# Altium schematic sheet 0093_CONNECTIVITY - M.SchDoc
size 848 x 558 mm
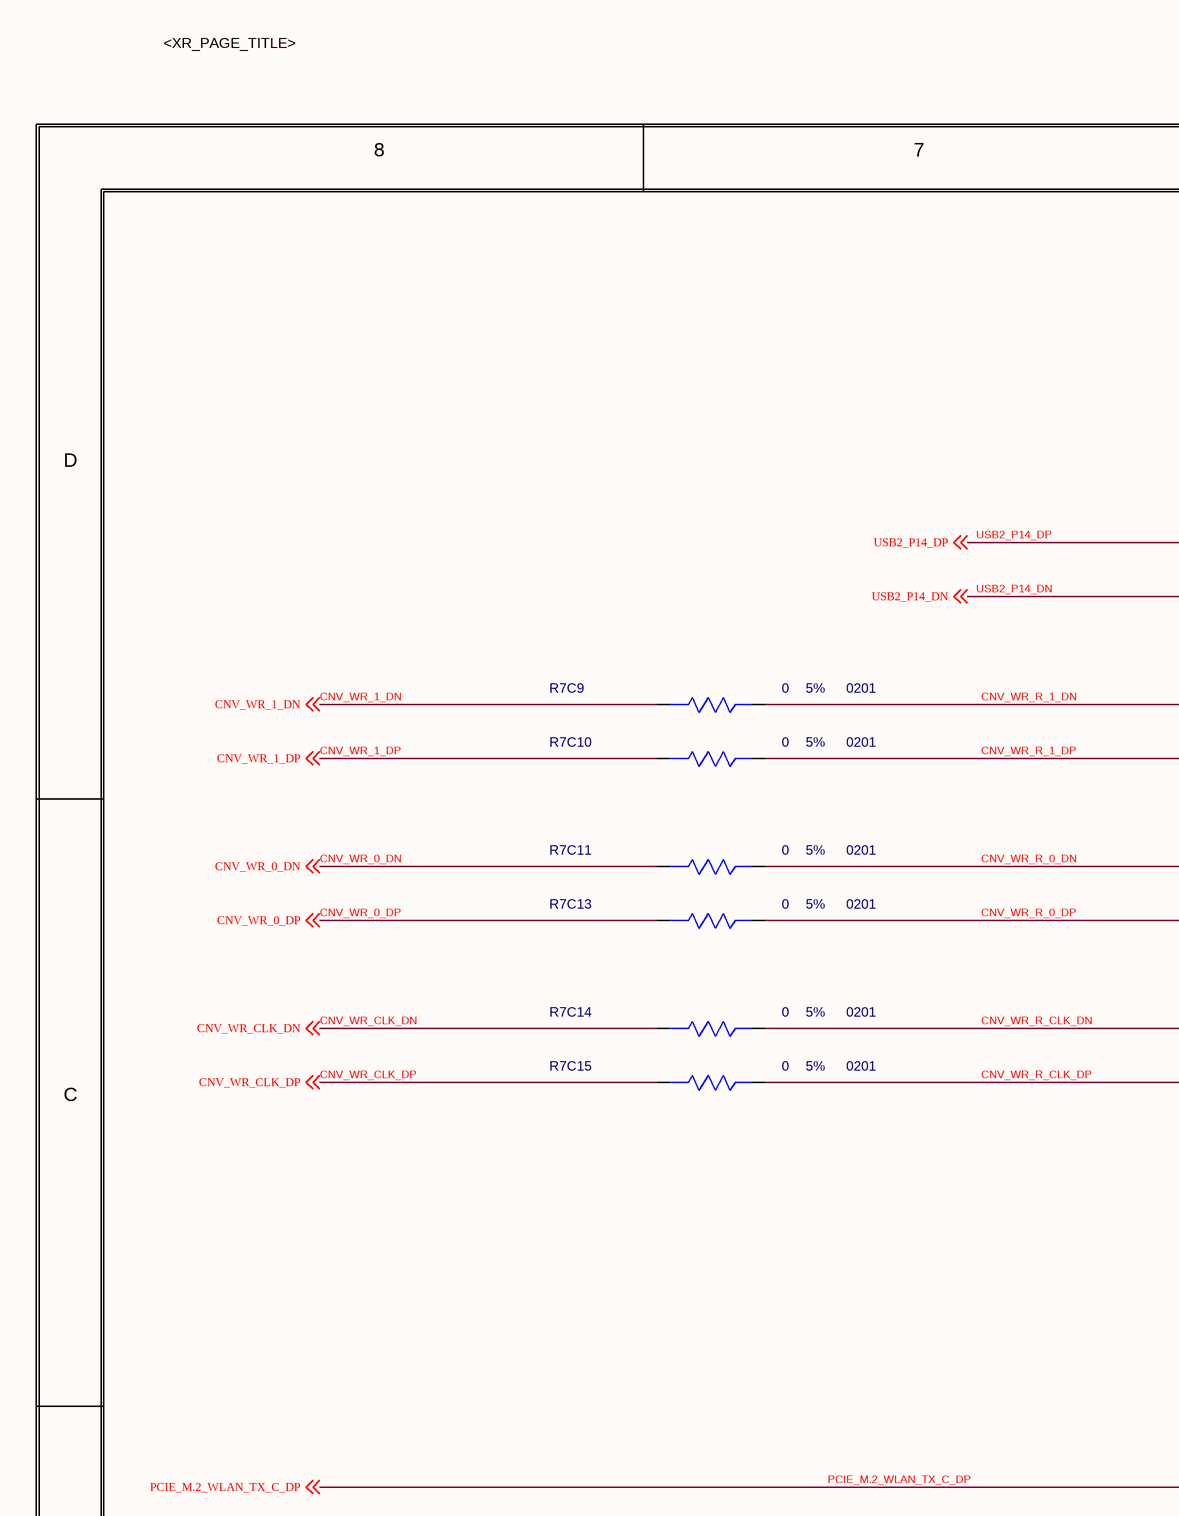
[diagram p0: 0093_CONNECTIVITY - M.SchDoc, top left]
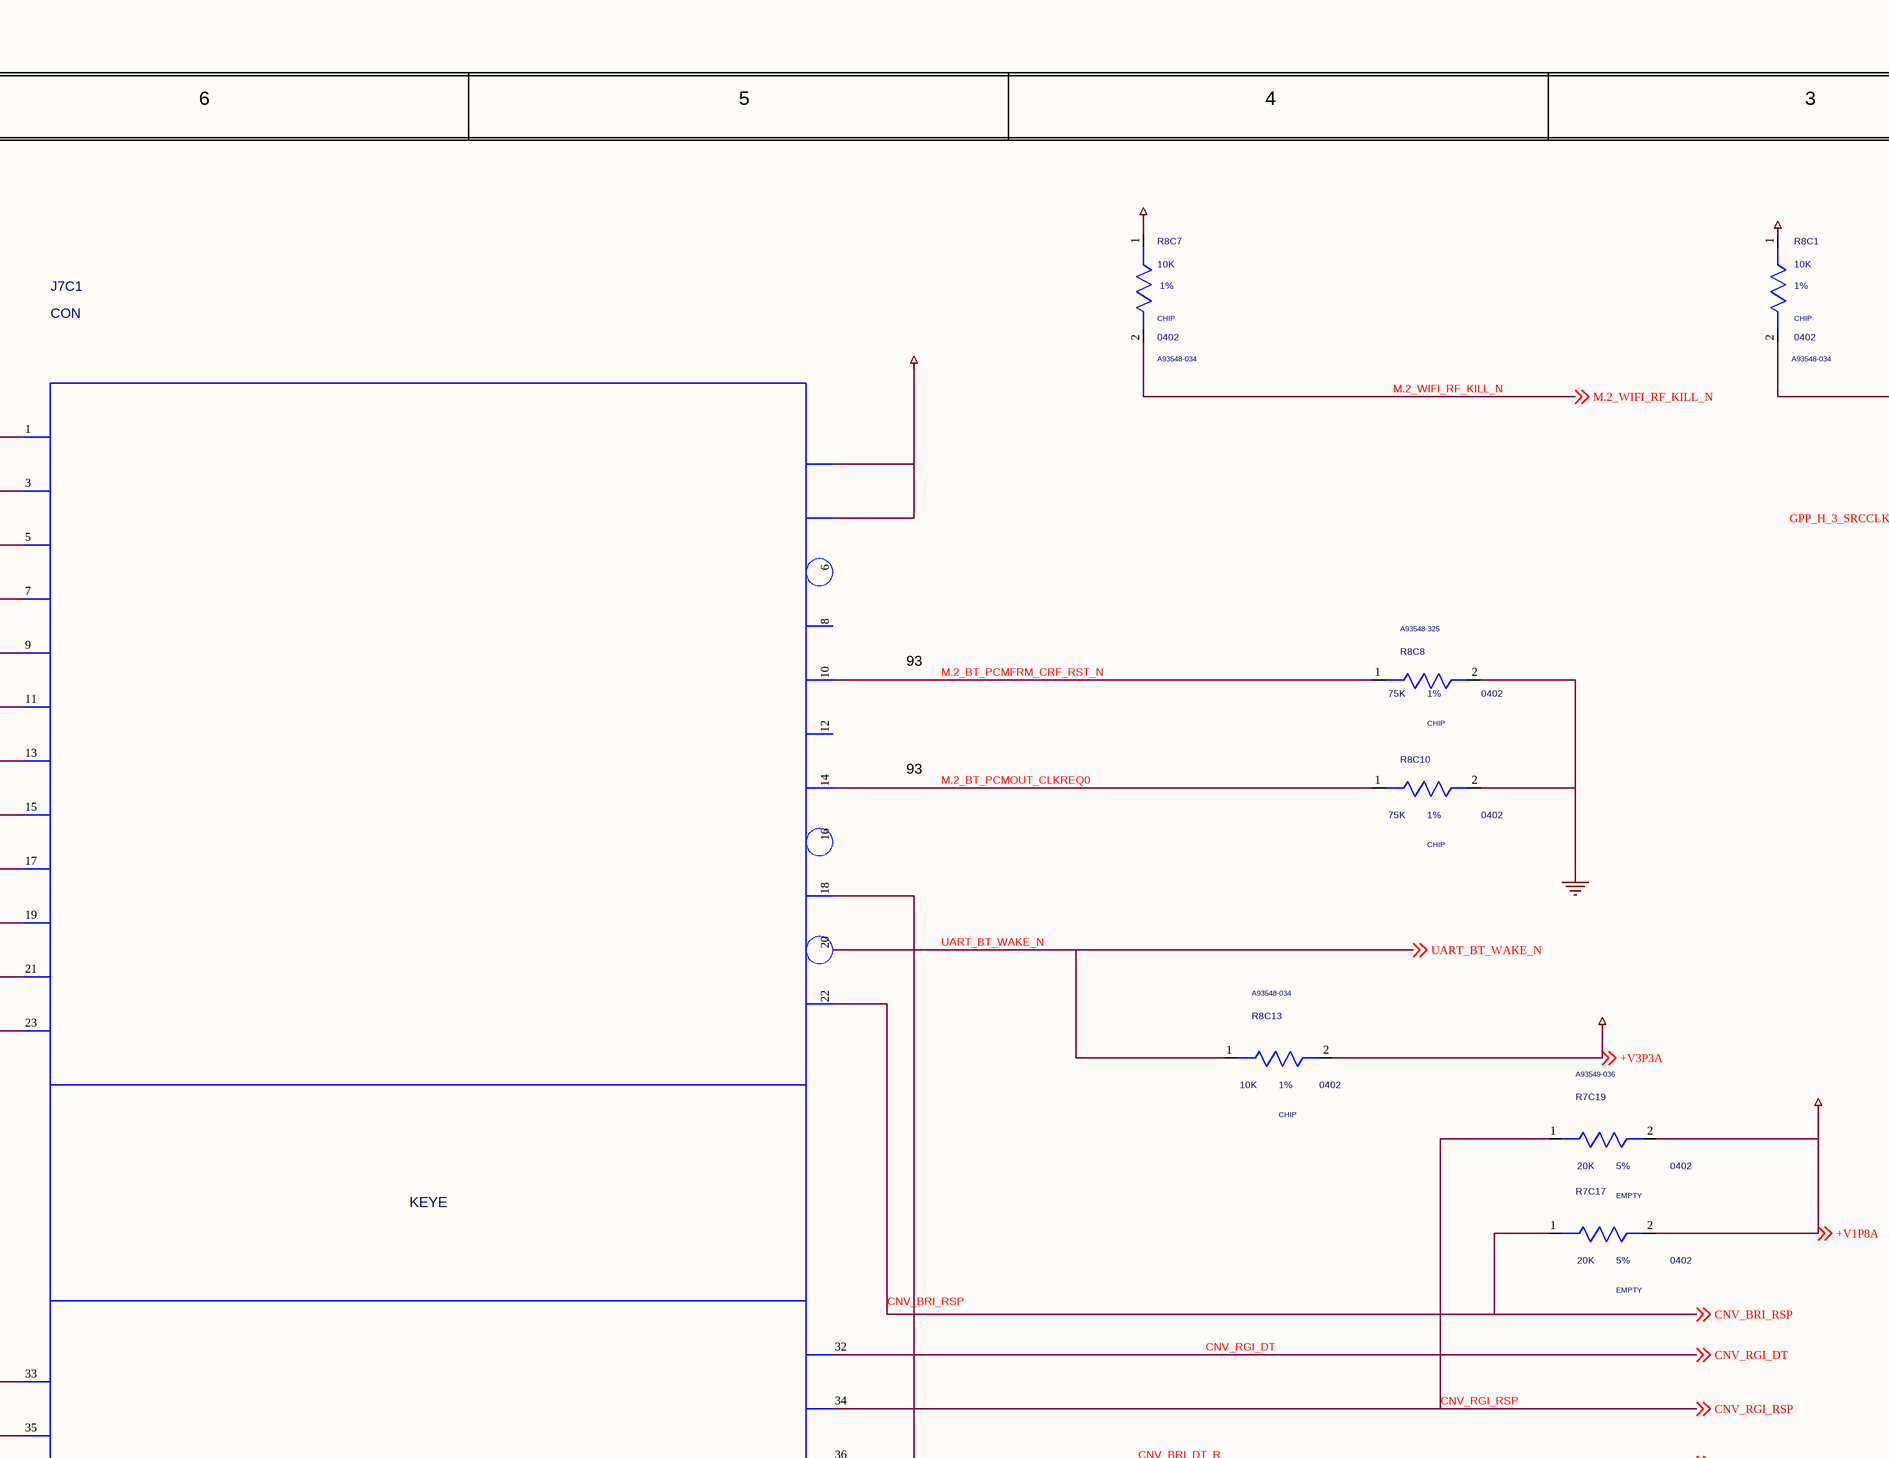
[diagram p1: 0093_CONNECTIVITY - M.SchDoc, top middle]
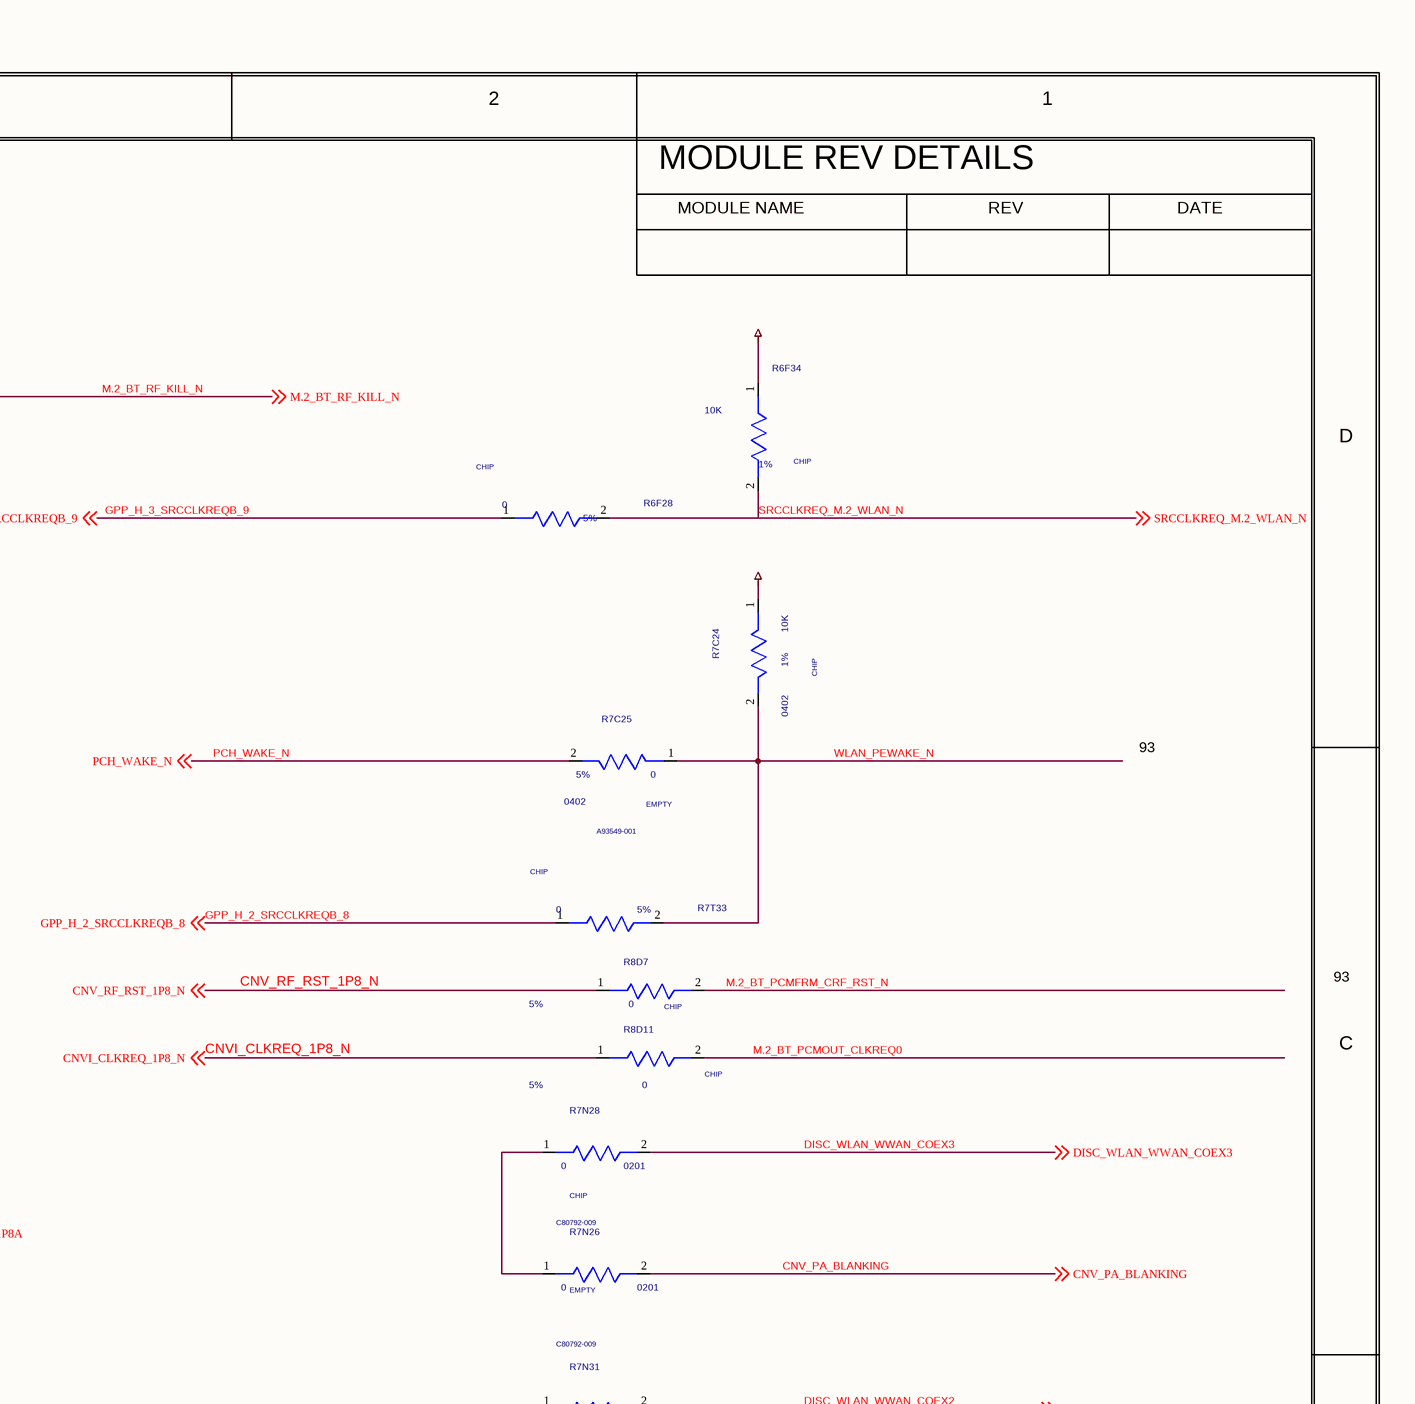
[diagram p2: 0093_CONNECTIVITY - M.SchDoc, top right]
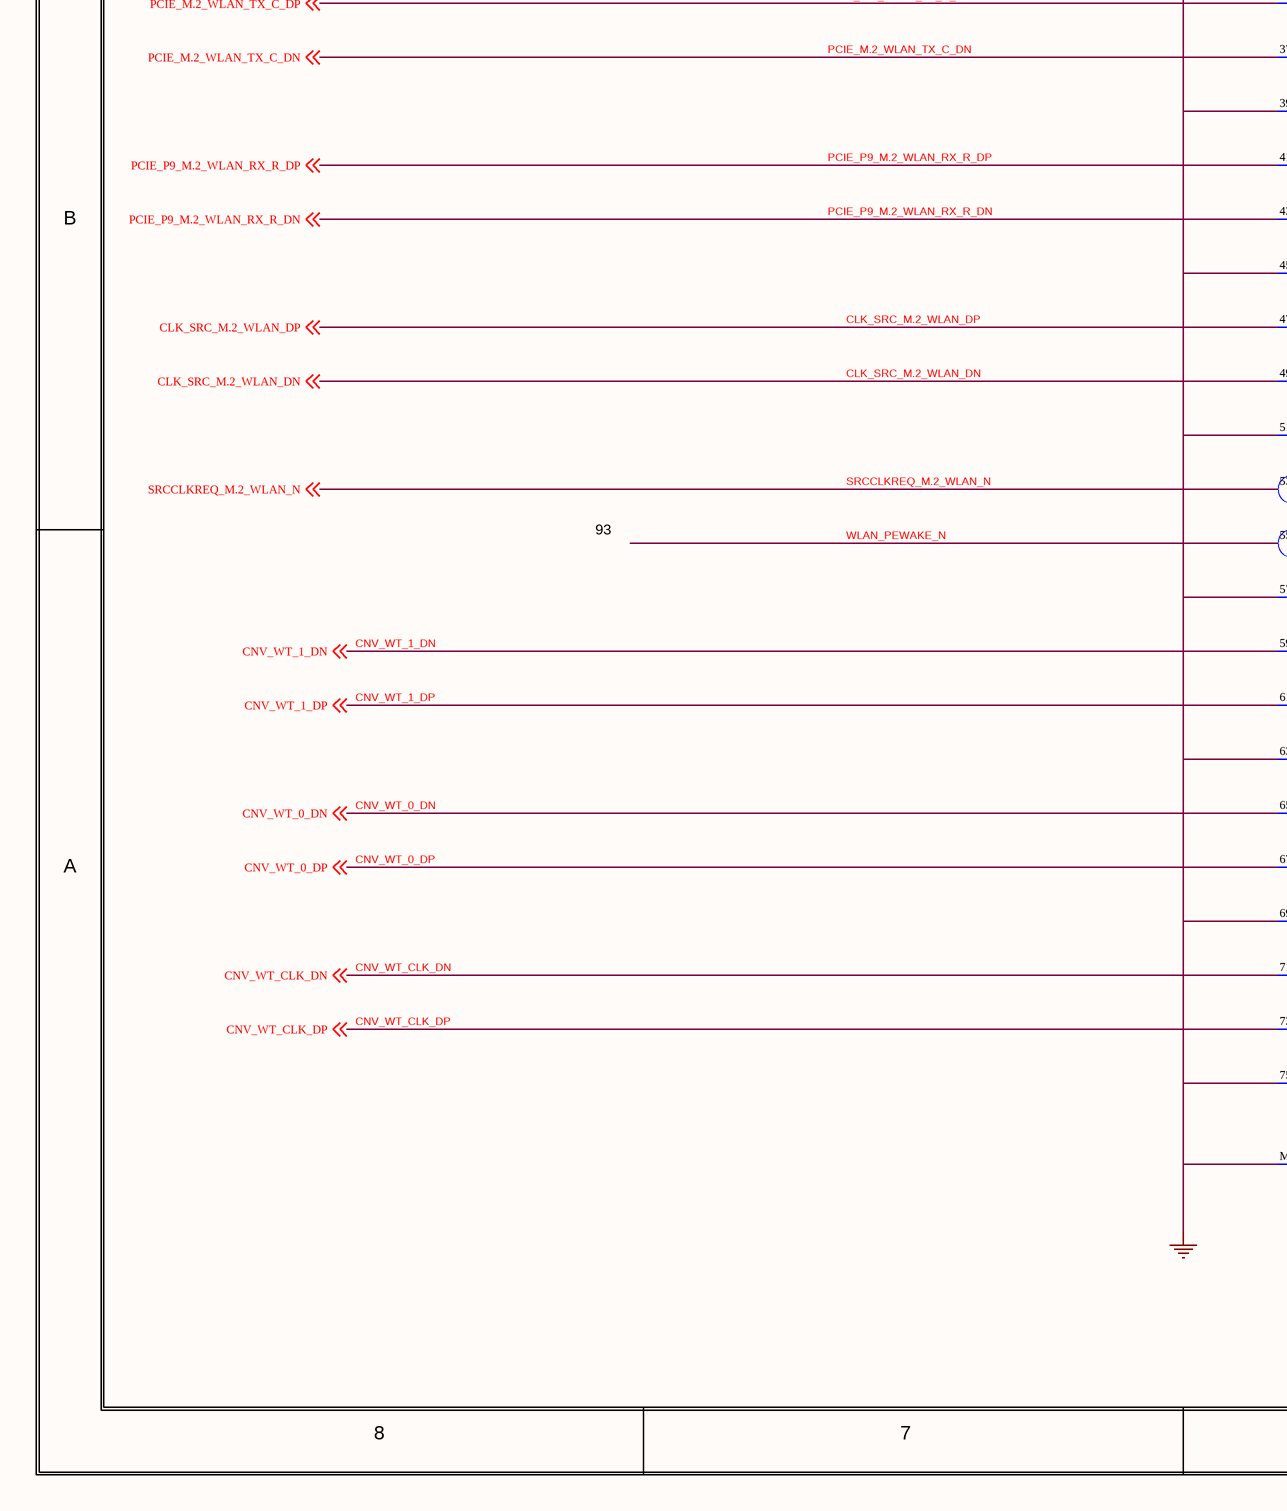
[diagram p3: 0093_CONNECTIVITY - M.SchDoc, bottom left]
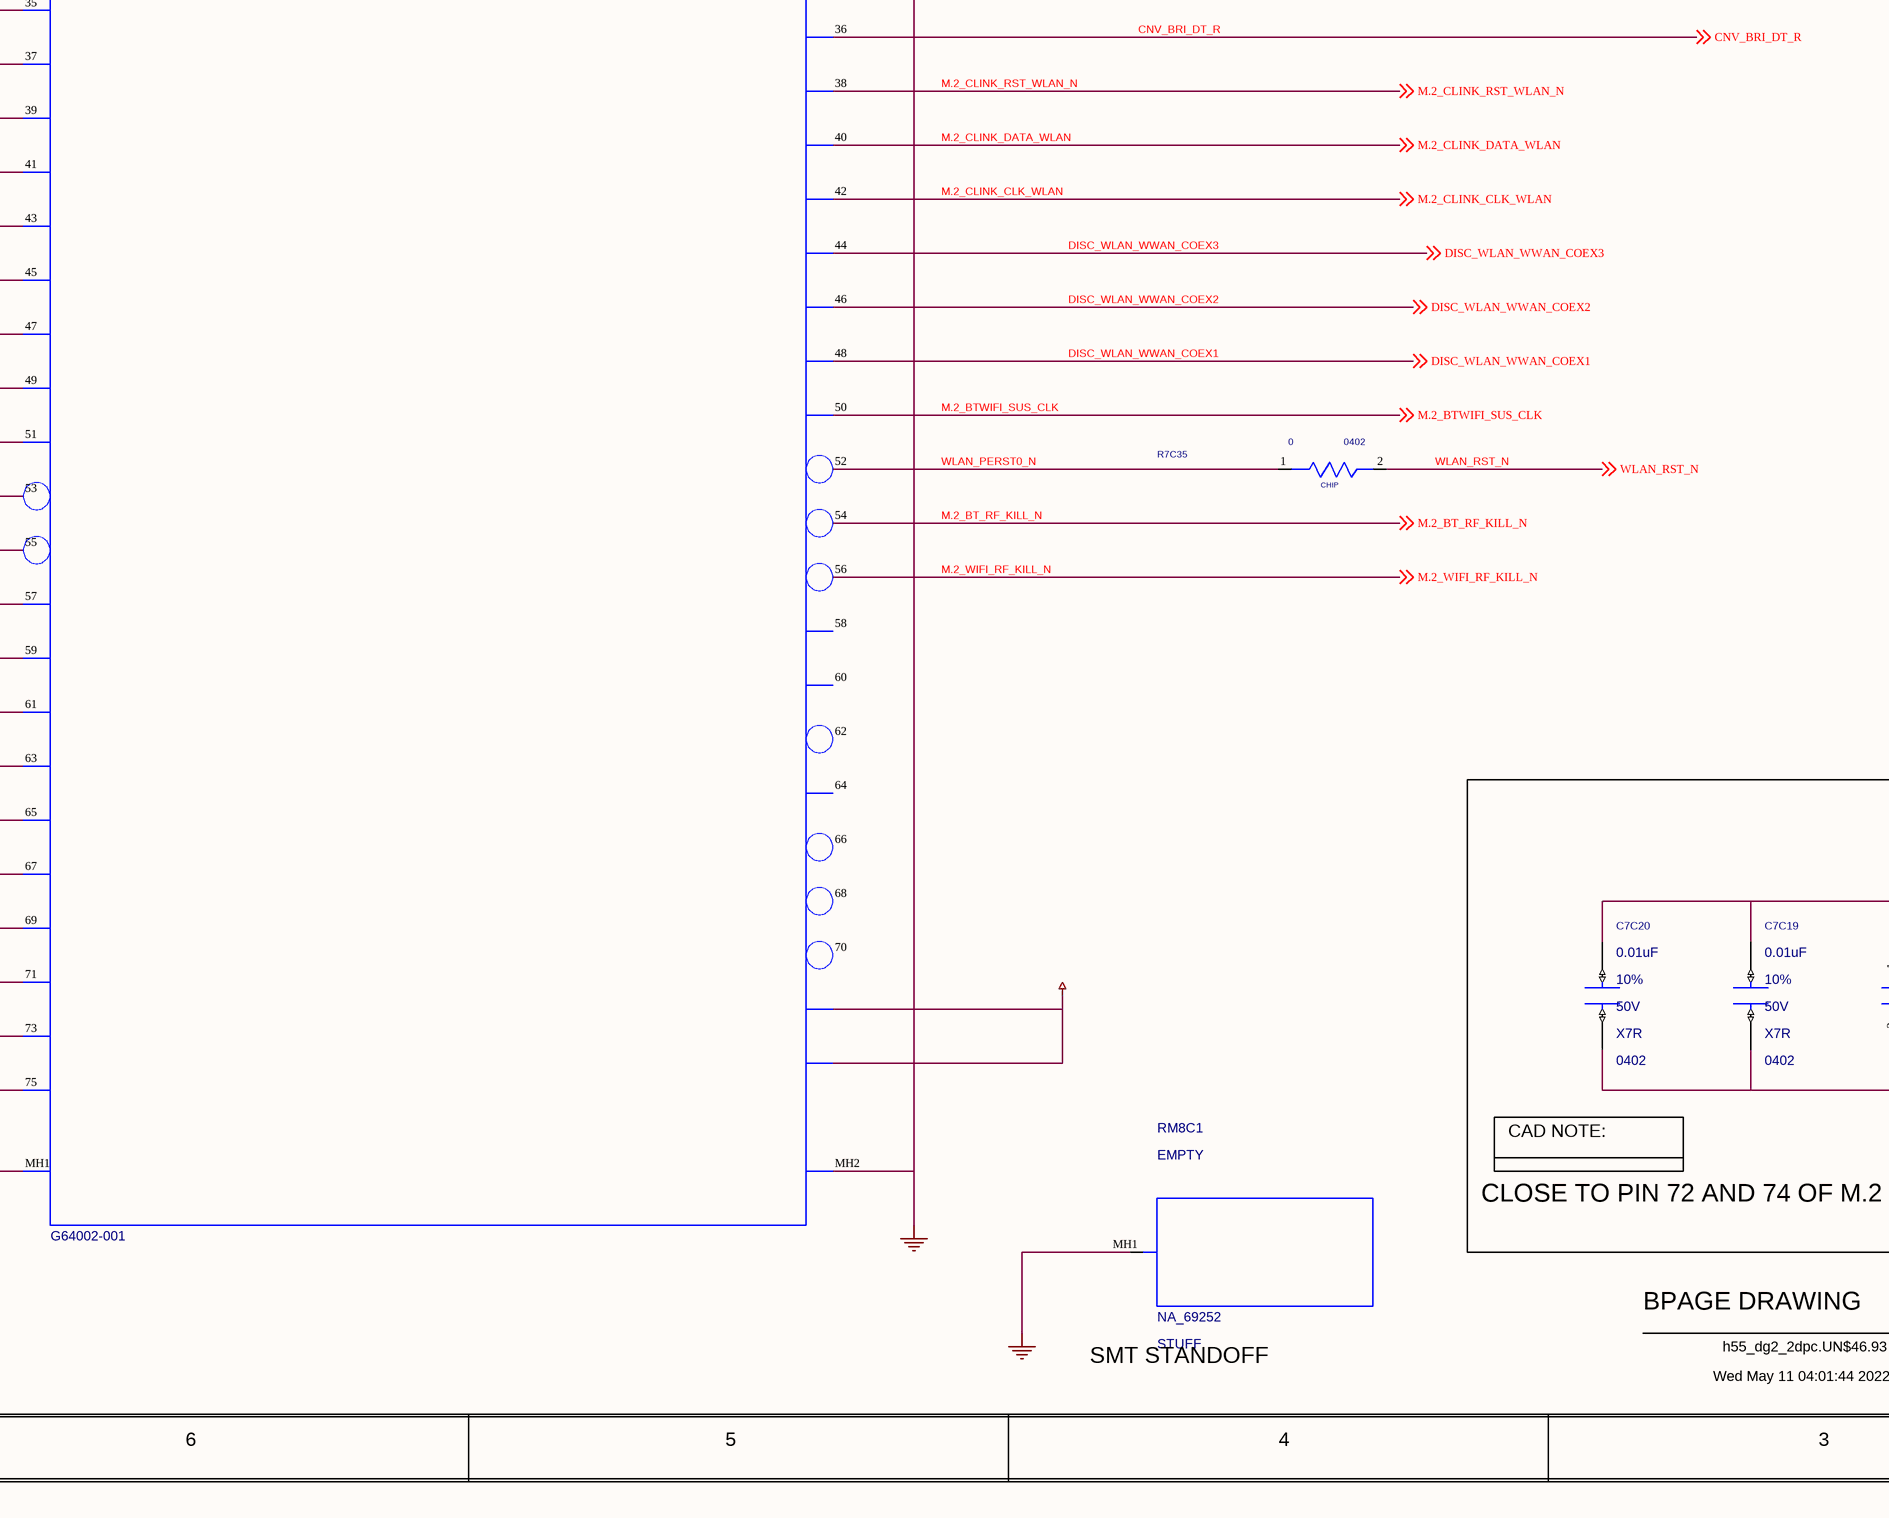
[diagram p4: 0093_CONNECTIVITY - M.SchDoc, bottom middle]
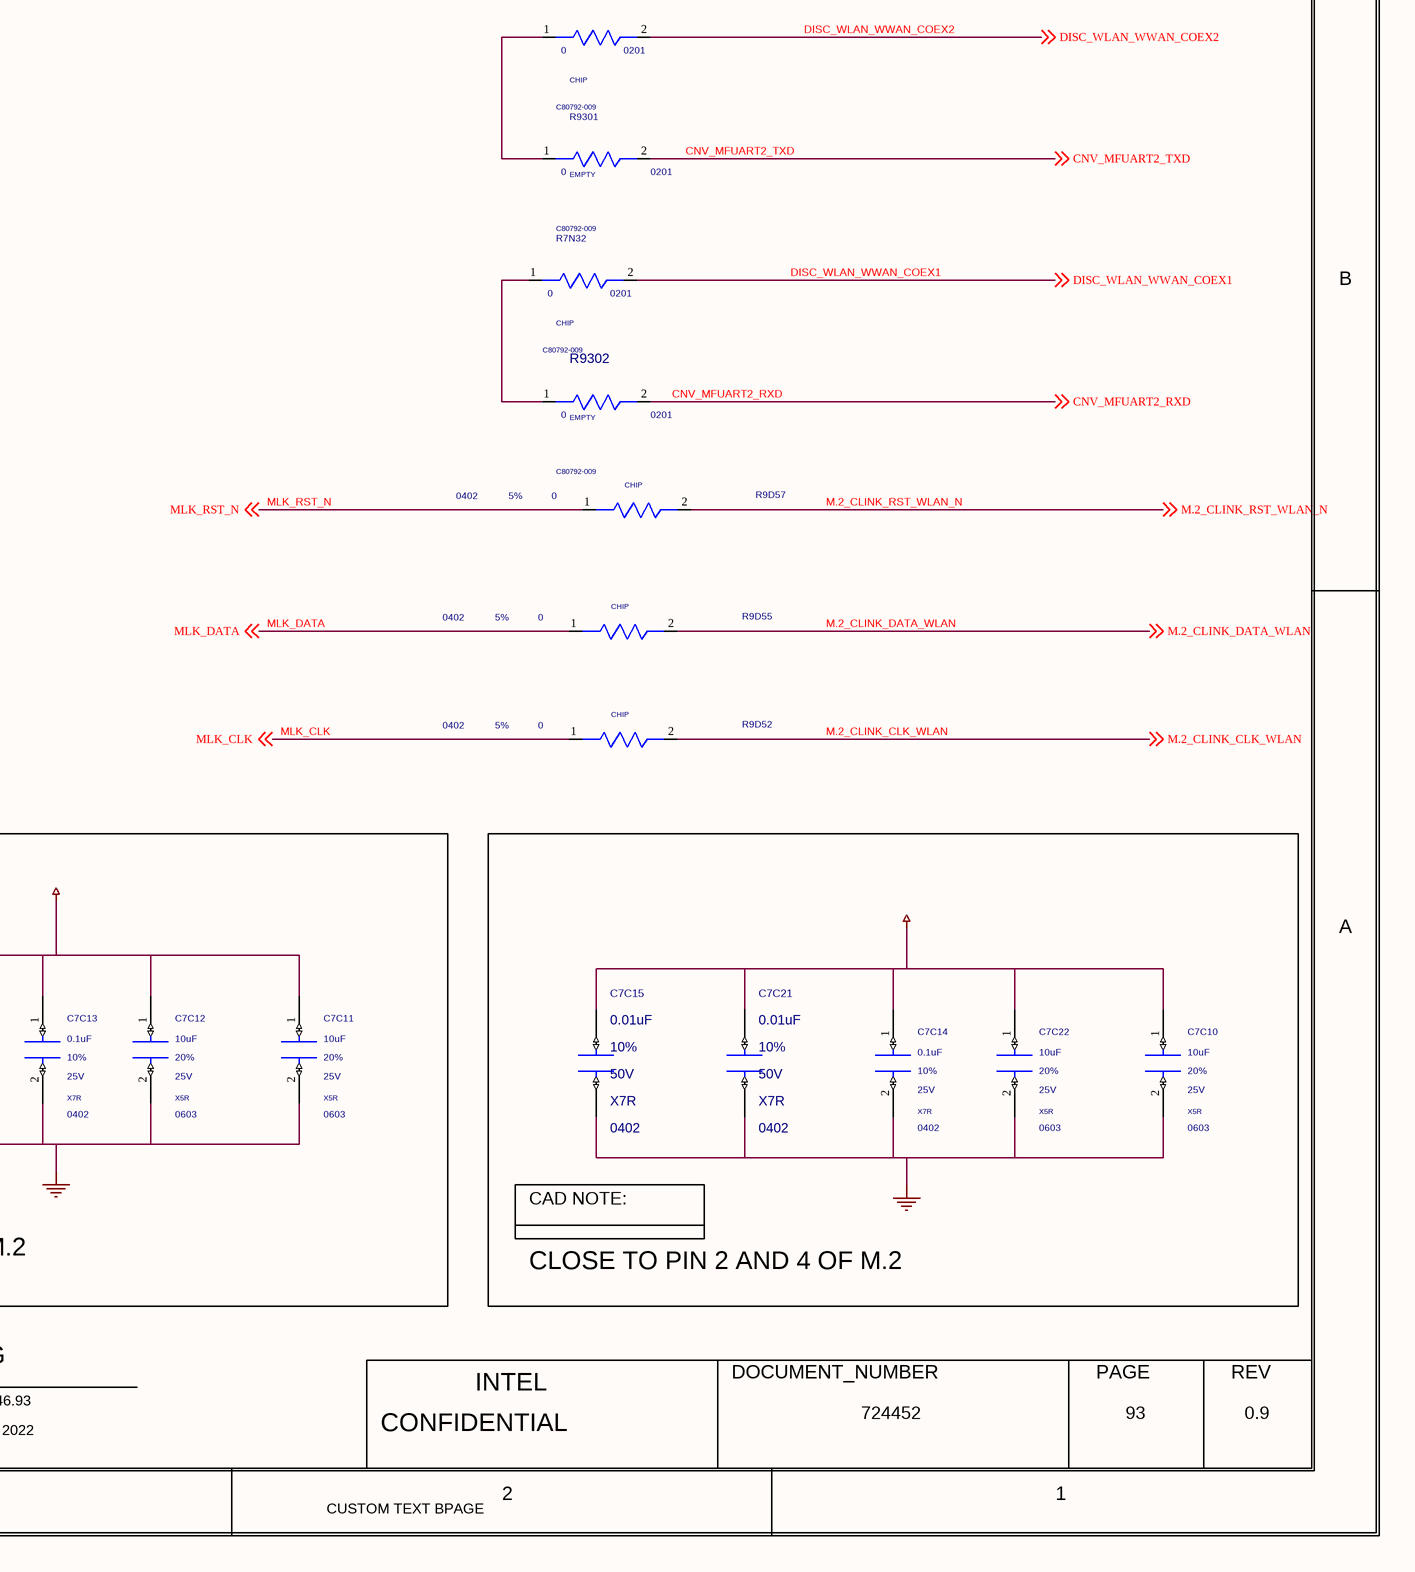
[diagram p5: 0093_CONNECTIVITY - M.SchDoc, bottom right]

## Parts
C7C10  10uF  MATERIAL: X5R  PACK_TYPE: 0603  TOLERANCE: 20%  VOLTAGE: 25V  [SMC0603IA]
C7C11  10uF  MATERIAL: X5R  PACK_TYPE: 0603  TOLERANCE: 20%  VOLTAGE: 25V  [SMC0603IA]
C7C12  10uF  MATERIAL: X5R  PACK_TYPE: 0603  TOLERANCE: 20%  VOLTAGE: 25V  [SMC0603IA]
C7C13  0.1uF  MATERIAL: X7R  PACK_TYPE: 0402  TOLERANCE: 10%  VOLTAGE: 25V  [SMC0402IA]
C7C14  0.1uF  MATERIAL: X7R  PACK_TYPE: 0402  TOLERANCE: 10%  VOLTAGE: 25V  [SMC0402IA]
C7C15  0.01uF  MATERIAL: X7R  PACK_TYPE: 0402  TOLERANCE: 10%  VOLTAGE: 50V  [CTK2_SM0402_1050X550_MA]
C7C19  0.01uF  MATERIAL: X7R  PACK_TYPE: 0402  TOLERANCE: 10%  VOLTAGE: 50V  [CTK2_SM0402_1050X550_MA]
C7C20  0.01uF  MATERIAL: X7R  PACK_TYPE: 0402  TOLERANCE: 10%  VOLTAGE: 50V  [CTK2_SM0402_1050X550_MA]
C7C21  0.01uF  MATERIAL: X7R  PACK_TYPE: 0402  TOLERANCE: 10%  VOLTAGE: 50V  [CTK2_SM0402_1050X550_MA]
C7C22  10uF  MATERIAL: X5R  PACK_TYPE: 0603  TOLERANCE: 20%  VOLTAGE: 25V  [SMC0603IA]
J7C1  MATERIAL: CON  PART_NUMBER: G64002-001  [CTK0_M2_SJR_75P_KEYE_2EM_2M_500_MA_VR]  (hidden comment: C_M2_75P_KEYE_2EM)
R6F28  0  MATERIAL: CHIP  TOLERANCE: 5%  [SMR0402IA]
R6F34  10K  MATERIAL: CHIP  TOLERANCE: 1%  [SMR0402IA]
R7C9  0  PACK_TYPE: 0201  TOLERANCE: 5%  [CTK2_SM0201_630X330_MA]
R7C10  0  PACK_TYPE: 0201  TOLERANCE: 5%  [CTK2_SM0201_630X330_MA]
R7C11  0  PACK_TYPE: 0201  TOLERANCE: 5%  [CTK2_SM0201_630X330_MA]
R7C13  0  PACK_TYPE: 0201  TOLERANCE: 5%  [CTK2_SM0201_630X330_MA]
R7C14  0  PACK_TYPE: 0201  TOLERANCE: 5%  [CTK2_SM0201_630X330_MA]
R7C15  0  PACK_TYPE: 0201  TOLERANCE: 5%  [CTK2_SM0201_630X330_MA]
R7C17  20K  MATERIAL: EMPTY  PACK_TYPE: 0402  TOLERANCE: 5%  [SMR0402IA]
R7C19  20K  MATERIAL: EMPTY  PACK_TYPE: 0402  PART_NUMBER: A93549-036  TOLERANCE: 5%  [SMR0402IA]
R7C24  10K  MATERIAL: CHIP  PACK_TYPE: 0402  TOLERANCE: 1%  [SMR0402IA]
R7C25  0  MATERIAL: EMPTY  PACK_TYPE: 0402  PART_NUMBER: A93549-001  TOLERANCE: 5%  [SMR0402IA]
R7C35  0  MATERIAL: CHIP  PACK_TYPE: 0402  [SMR0402IA]
R7N26  0  MATERIAL: EMPTY  PACK_TYPE: 0201  PART_NUMBER: C80792-009  [SMR0201IA]
R7N28  0  MATERIAL: CHIP  PACK_TYPE: 0201  PART_NUMBER: C80792-009  [SMR0201IA]
R7N31  0  MATERIAL: CHIP  PACK_TYPE: 0201  PART_NUMBER: C80792-009  [SMR0201IA]
R7N32  0  MATERIAL: CHIP  PACK_TYPE: 0201  PART_NUMBER: C80792-009  [SMR0201IA]
R7T33  0  MATERIAL: CHIP  TOLERANCE: 5%  [SMR0402IA]
R8C1  10K  MATERIAL: CHIP  PACK_TYPE: 0402  PART_NUMBER: A93548-034  TOLERANCE: 1%  [SMR0402IA]
R8C7  10K  MATERIAL: CHIP  PACK_TYPE: 0402  PART_NUMBER: A93548-034  TOLERANCE: 1%  [SMR0402IA]
R8C8  75K  MATERIAL: CHIP  PACK_TYPE: 0402  PART_NUMBER: A93548-325  TOLERANCE: 1%  [SMR0402IA]
R8C10  75K  MATERIAL: CHIP  PACK_TYPE: 0402  TOLERANCE: 1%  [SMR0402IA]
R8C13  10K  MATERIAL: CHIP  PACK_TYPE: 0402  PART_NUMBER: A93548-034  TOLERANCE: 1%  [SMR0402IA]
R8D7  0  MATERIAL: CHIP  TOLERANCE: 5%  [SMR0402IA]
R8D11  0  MATERIAL: CHIP  TOLERANCE: 5%  [SMR0402IA]
R9D52  0  MATERIAL: CHIP  PACK_TYPE: 0402  TOLERANCE: 5%  [SMR0402IA]
R9D55  0  MATERIAL: CHIP  PACK_TYPE: 0402  TOLERANCE: 5%  [SMR0402IA]
R9D57  0  MATERIAL: CHIP  PACK_TYPE: 0402  TOLERANCE: 5%  [SMR0402IA]
R9301  0  MATERIAL: EMPTY  PACK_TYPE: 0201  PART_NUMBER: C80792-009  [SMR0201IA]
R9302  0  MATERIAL: EMPTY  PACK_TYPE: 0201  PART_NUMBER: C80792-009  [SMR0201IA]
RM8C1  BOM_USE: STUFF  MATERIAL: EMPTY  PART_NUMBER: NA_69252  [MTG_5000P3500_MA]  (hidden comment: MTG_HOLE_2)

## Blocks framed on the sheet
CLOSE TO PIN 72 AND 74 OF M.2: C7C11-C7C13 C7C19 C7C20
CLOSE TO PIN 2 AND 4 OF M.2: C7C10 C7C14 C7C15 C7C21 C7C22

## Nets
3P3V_2: J7C1.2(3P3V_2)
3P3V_4: J7C1.4(3P3V_4)
3P3V_72: J7C1.72(3P3V_72)
3P3V_74: J7C1.74(3P3V_74)
+V1P8A: R7C17.2(B) R7C19.2(B) ; off-sheet +V1P8A
+V3P3_SLOTE: C7C10.1(A) C7C11.1(A) C7C12.1(A) C7C13.1(A) C7C14.1(A) C7C15.1(A) C7C19.1(A) C7C20.1(A) C7C21.1(A) C7C22.1(A) R8C1.1(A) R8C7.1(A)
+V3P3A: R6F34.1(A) R7C24.1(A) R8C13.2(B) ; off-sheet +V3P3A
GND: C7C10.2(B) C7C11.2(B) C7C12.2(B) C7C13.2(B) C7C14.2(B) C7C15.2(B) C7C19.2(B) C7C20.2(B) C7C21.2(B) C7C22.2(B) J7C1.1(GND_1) J7C1.7(GND_7) J7C1.13(SDIO_DATA0) J7C1.18(GND_18) J7C1.19(SDIO_DATA3) J7C1.33(GND_33) J7C1.39(GND_39) J7C1.45(GND_45) J7C1.51(GND_51) J7C1.57(GND_57) J7C1.63(GND_63) J7C1.69(GND_69) J7C1.75(GND_75) J7C1.MH1 J7C1.MH2 R8C8.2(B) R8C10.2(B) RM8C1.MH1
CLK_SRC_M.2_WLAN_DN: J7C1.49(REFCLKN0) ; off-sheet CLK_SRC_M.2_WLAN_DN
CLK_SRC_M.2_WLAN_DP: J7C1.47(REFCLKP0) ; off-sheet CLK_SRC_M.2_WLAN_DP
CNV_BRI_DT_R: J7C1.36(UART_RTS) ; off-sheet CNV_BRI_DT_R
CNV_BRI_RSP: J7C1.22(UART_RXD) R7C17.1(A) ; off-sheet CNV_BRI_RSP
CNV_MFUART2_RXD: R9302.2(B) ; off-sheet CNV_MFUART2_RXD
CNV_MFUART2_TXD: R9301.2(B) ; off-sheet CNV_MFUART2_TXD
CNV_PA_BLANKING: R7N26.2(B) ; off-sheet CNV_PA_BLANKING
CNV_RF_RST_1P8_N: R8D7.1(A) ; off-sheet CNV_RF_RST_1P8_N
CNV_RGI_DT: J7C1.32(UART_TXD) ; off-sheet CNV_RGI_DT
CNV_RGI_RSP: J7C1.34(UART_CTS) R7C19.1(A) ; off-sheet CNV_RGI_RSP
CNV_WR_0_DN: R7C11.1(A) ; off-sheet CNV_WR_0_DN
CNV_WR_0_DP: R7C13.1(A) ; off-sheet CNV_WR_0_DP
CNV_WR_1_DN: R7C9.1(A) ; off-sheet CNV_WR_1_DN
CNV_WR_1_DP: R7C10.1(A) ; off-sheet CNV_WR_1_DP
CNV_WR_CLK_DN: R7C14.1(A) ; off-sheet CNV_WR_CLK_DN
CNV_WR_CLK_DP: R7C15.1(A) ; off-sheet CNV_WR_CLK_DP
CNV_WR_R_0_DN: J7C1.15(SDIO_DATA1) R7C11.2(B)
CNV_WR_R_0_DP: J7C1.17(SDIO_DATA2) R7C13.2(B)
CNV_WR_R_1_DN: J7C1.9(SDIO_CLK_SYSCLK) R7C9.2(B)
CNV_WR_R_1_DP: J7C1.11(SDIO_CMD) R7C10.2(B)
CNV_WR_R_CLK_DN: J7C1.21(SDIO_WAKE_N) R7C14.2(B)
CNV_WR_R_CLK_DP: J7C1.23(SDIO_RESET_TX_BLANKING_N) R7C15.2(B)
CNV_WT_0_DN: J7C1.65(RESERVED_PERP1) ; off-sheet CNV_WT_0_DN
CNV_WT_0_DP: J7C1.67(RESERVED_PERN1) ; off-sheet CNV_WT_0_DP
CNV_WT_1_DN: J7C1.59(RESERVED_PETP1) ; off-sheet CNV_WT_1_DN
CNV_WT_1_DP: J7C1.61(RESERVED_PETN1) ; off-sheet CNV_WT_1_DP
CNV_WT_CLK_DN: J7C1.71(RESERVED_REFCLKP1) ; off-sheet CNV_WT_CLK_DN
CNV_WT_CLK_DP: J7C1.73(RESERVED_REFCLKN1) ; off-sheet CNV_WT_CLK_DP
CNVI_CLKREQ_1P8_N: R8D11.1(A) ; off-sheet CNVI_CLKREQ_1P8_N
DISC_WLAN_WWAN_COEX1: J7C1.48(COEX_TXD) R7N32.2(B) ; off-sheet DISC_WLAN_WWAN_COEX1
DISC_WLAN_WWAN_COEX2: J7C1.46(COEX_RXD) R7N31.2(B) ; off-sheet DISC_WLAN_WWAN_COEX2
DISC_WLAN_WWAN_COEX3: J7C1.44(COEX3) R7N28.2(B) ; off-sheet DISC_WLAN_WWAN_COEX3
GPP_H_2_SRCCLKREQB_8: R7T33.1(A) ; off-sheet GPP_H_2_SRCCLKREQB_8
GPP_H_3_SRCCLKREQB_9: R6F28.1(A) ; off-sheet GPP_H_3_SRCCLKREQB_9
M.2_BT_PCMFRM_CRF_RST_N: J7C1.10(PCM_SYNC_I2S_WS) R8C8.1(A) R8D7.2(B)
M.2_BT_PCMOUT_CLKREQ0: J7C1.14(PCM_OUT_I2S_SD_OUT) R8C10.1(A) R8D11.2(B)
M.2_BT_RF_KILL_N: J7C1.54(W_DISABLE2_N) R8C1.2(B) ; off-sheet M.2_BT_RF_KILL_N
M.2_BTWIFI_SUS_CLK: J7C1.50(SUSCLK) ; off-sheet M.2_BTWIFI_SUS_CLK
M.2_CLINK_CLK_WLAN: J7C1.42(VENDOR_DEFINED_42) R9D52.2(B) ; off-sheet M.2_CLINK_CLK_WLAN
M.2_CLINK_DATA_WLAN: J7C1.40(VENDOR_DEFINED_40) R9D55.2(B) ; off-sheet M.2_CLINK_DATA_WLAN
M.2_CLINK_RST_WLAN_N: J7C1.38(VENDOR_DEFINED_38) R9D57.2(B) ; off-sheet M.2_CLINK_RST_WLAN_N
M.2_WIFI_RF_KILL_N: J7C1.56(W_DISABLE1_N) R8C7.2(B) ; off-sheet M.2_WIFI_RF_KILL_N
MLK_CLK: R9D52.1(A) ; off-sheet MLK_CLK
MLK_DATA: R9D55.1(A) ; off-sheet MLK_DATA
MLK_RST_N: R9D57.1(A) ; off-sheet MLK_RST_N
PCH_WAKE_N: R7C25.2(B) ; off-sheet PCH_WAKE_N
PCIE_M.2_WLAN_TX_C_DN: J7C1.37(PETN0) ; off-sheet PCIE_M.2_WLAN_TX_C_DN
PCIE_M.2_WLAN_TX_C_DP: J7C1.35(PETP0) ; off-sheet PCIE_M.2_WLAN_TX_C_DP
PCIE_P9_M.2_WLAN_RX_R_DN: J7C1.43(PERN0) ; off-sheet PCIE_P9_M.2_WLAN_RX_R_DN
PCIE_P9_M.2_WLAN_RX_R_DP: J7C1.41(PERP0) ; off-sheet PCIE_P9_M.2_WLAN_RX_R_DP
SRCCLKREQ_M.2_WLAN_N: J7C1.53(CLKREQ0_N) R6F28.2(B) R6F34.2(B) ; off-sheet SRCCLKREQ_M.2_WLAN_N
UART_BT_WAKE_N: J7C1.20(UART_WAKE_N) R8C13.1(A) ; off-sheet UART_BT_WAKE_N
UNNAMED_464_RES_I545_A: R7N26.1(A) R7N28.1(A)
UNNAMED_464_RES_I550_A: R7N31.1(A) R9301.1(A)
UNNAMED_464_RES_I555_A: R7N32.1(A) R9302.1(A)
USB2_P14_DN: J7C1.5(USB_DN) ; off-sheet USB2_P14_DN
USB2_P14_DP: J7C1.3(USB_DP) ; off-sheet USB2_P14_DP
WLAN_PERST0_N: J7C1.52(PERST0_N) R7C35.1(A)
WLAN_PEWAKE_N: J7C1.55(PEWAKE0_N) R7C24.2(B) R7C25.1(A) R7T33.2(B)
WLAN_RST_N: R7C35.2(B) ; off-sheet WLAN_RST_N

Not connected (* = marked no-connect by the designer): J7C1 6(LED_1_N) 8(PCM_CLK_I2S_SCK) 12(PCM_IN_I2S_SD_IN) 16(LED_2_N) 58(I2C_DATA) 60(I2C_CLK) 62(ALERT_N) 64(RESERVED) 66(UIM_SWP_PERST1_N) 68(UIM_POWER_SNK_CLKREQ1_N) 70(UIM_POWER_SRC_GPIO_1_PEWAKE1_N)

## Notes on the sheet
- <XR_PAGE_TITLE>
- 8
- 7
- 6
- 5
- 4
- 3
- 2
- 1
- MODULE REV DETAILS
- MODULE NAME
- REV
- DATE
- D
- 93
- C
- B
- A
- CAD NOTE:
- BPAGE DRAWING
- INTEL
- DOCUMENT_NUMBER
- PAGE
- SMT STANDOFF
- Wed May 11 04:01:44 2022
- h55_dg2_2dpc.UN$46.93
- CONFIDENTIAL
- 724452
- 0.9
- CUSTOM TEXT BPAGE
- (in symbol C_M2_75P_KEYE_2EM) KEYE

## Library data of the parts
C7C10 = CAP: PART_NUMBER: G33975-001; CDS_PHYS_PART_NAME: CAP_0603-G33975-001,X5R,10UF,25V,20%,LPDB,GENERIC; OriginalSymbolOrigin: (-50,25); XY: (-275,750); VER: 1; ROT: 0; PHYS_PAGE: 93; LOCATION: C7C10; IP: GENERIC; FP_TECH: LPDB; DRAWING: @RVP1_ADL_SB_ADP_S_DDR5_SODIMM_2DPC_LIB.H55_DG2_2DPC(SCH_1):PAGE464; CDS_LIB: discrete; PCB Footprint: SMC0603IA; CHIPS_PART_NAME: CAP; CDS_PART_NAME: CAP_0603-G33975-001,X5R,10UF,25V,20%,LPDB,GENERIC; CDS_LOCATION: C7C10; ASI_MODEL: G33975-001
C7C11 = CAP: PART_NUMBER: G33975-001; CDS_PHYS_PART_NAME: CAP_0603-G33975-001,X5R,10UF,25V,20%,LPDB,GENERIC; OriginalSymbolOrigin: (-50,25); XY: (-1875,775); VER: 1; ROT: 0; PHYS_PAGE: 93; LOCATION: C7C11; IP: GENERIC; FP_TECH: LPDB; DRAWING: @RVP1_ADL_SB_ADP_S_DDR5_SODIMM_2DPC_LIB.H55_DG2_2DPC(SCH_1):PAGE464; CDS_LIB: discrete; PCB Footprint: SMC0603IA; CHIPS_PART_NAME: CAP; CDS_PART_NAME: CAP_0603-G33975-001,X5R,10UF,25V,20%,LPDB,GENERIC; CDS_LOCATION: C7C11; ASI_MODEL: G33975-001
C7C12 = CAP: PART_NUMBER: G33975-001; CDS_PHYS_PART_NAME: CAP_0603-G33975-001,X5R,10UF,25V,20%,LPDB,GENERIC; OriginalSymbolOrigin: (-50,25); sec: 1; XY: (-2150,775); ROT: 0; PHYS_PAGE: 93; LOCATION: C7C12; IP: GENERIC; FP_TECH: LPDB; DRAWING: @RVP1_ADL_SB_ADP_S_DDR5_SODIMM_2DPC_LIB.H55_DG2_2DPC(SCH_1):PAGE464; CDS_LIB: discrete; PCB Footprint: SMC0603IA; VER: 1; CHIPS_PART_NAME: CAP; CDS_PART_NAME: CAP_0603-G33975-001,X5R,10UF,25V,20%,LPDB,GENERIC; CDS_LOCATION: C7C12; ASI_MODEL: G33975-001
C7C13 = CAP: PART_NUMBER: A36096-112; CDS_PHYS_PART_NAME: CAP_0402-A36096-112,X7R,0.1UF,25V,10%,LPDB,GENERIC; OriginalSymbolOrigin: (-50,25); sec: 1; XY: (-2350,775); ROT: 0; PHYS_PAGE: 93; LOCATION: C7C13; IP: GENERIC; FP_TECH: LPDB; DRAWING: @RVP1_ADL_SB_ADP_S_DDR5_SODIMM_2DPC_LIB.H55_DG2_2DPC(SCH_1):PAGE464; CDS_LIB: discrete; PCB Footprint: SMC0402IA; VER: 1; CHIPS_PART_NAME: CAP; CDS_PART_NAME: CAP_0402-A36096-112,X7R,0.1UF,25V,10%,LPDB,GENERIC; CDS_LOCATION: C7C13; ASI_MODEL: A36096-112
C7C14 = CAP: PART_NUMBER: A36096-112; CDS_PHYS_PART_NAME: CAP_0402-A36096-112,X7R,0.1UF,25V,10%,LPDB,GENERIC; OriginalSymbolOrigin: (-50,25); sec: 1; XY: (-775,750); ROT: 0; PHYS_PAGE: 93; LOCATION: C7C14; IP: GENERIC; FP_TECH: LPDB; DRAWING: @RVP1_ADL_SB_ADP_S_DDR5_SODIMM_2DPC_LIB.H55_DG2_2DPC(SCH_1):PAGE464; CDS_LIB: discrete; PCB Footprint: SMC0402IA; VER: 1; CHIPS_PART_NAME: CAP; CDS_PART_NAME: CAP_0402-A36096-112,X7R,0.1UF,25V,10%,LPDB,GENERIC; CDS_LOCATION: C7C14; ASI_MODEL: A36096-112
C7C15 = C_CAP: PART_NUMBER: A36096-100; CDS_PHYS_PART_NAME: C_CAP_0402-A36096-100,X7R,0.01UF,50V,10%,TK2,GENERIC; CDS_LMAN_SYM_OUTLINE: -50,50,50,-50; FP_TECH: TK2; IP: GENERIC; ROOM: NONE; OriginalSymbolOrigin: (-50,25); XY: (-1325,750); VER: 1; ROT: 0; PHYS_PAGE: 93; LOCATION: C7C15; DRAWING: @RVP1_ADL_SB_ADP_S_DDR5_SODIMM_2DPC_LIB.H55_DG2_2DPC(SCH_1):PAGE464; CDS_LIB: c_discrete; VARIANT: ?; PCB Footprint: CTK2_SM0402_1050X550_MA; CHIPS_PART_NAME: C_CAP; CDS_PART_NAME: C_CAP_0402-A36096-100,X7R,0.01UF,50V,10%,TK2,GENERIC; CDS_LOCATION: C7C15
C7C19 = C_CAP: PART_NUMBER: A36096-100; CDS_PHYS_PART_NAME: C_CAP_0402-A36096-100,X7R,0.01UF,50V,10%,TK2,GENERIC; CDS_LMAN_SYM_OUTLINE: -50,50,50,-50; FP_TECH: TK2; IP: GENERIC; ROOM: NONE; OriginalSymbolOrigin: (-50,25); XY: (-2625,775); VER: 1; ROT: 0; PHYS_PAGE: 93; LOCATION: C7C19; DRAWING: @RVP1_ADL_SB_ADP_S_DDR5_SODIMM_2DPC_LIB.H55_DG2_2DPC(SCH_1):PAGE464; CDS_LIB: c_discrete; VARIANT: ?; PCB Footprint: CTK2_SM0402_1050X550_MA; CHIPS_PART_NAME: C_CAP; CDS_PART_NAME: C_CAP_0402-A36096-100,X7R,0.01UF,50V,10%,TK2,GENERIC; CDS_LOCATION: C7C19
C7C20 = C_CAP: PART_NUMBER: A36096-100; CDS_PHYS_PART_NAME: C_CAP_0402-A36096-100,X7R,0.01UF,50V,10%,TK2,GENERIC; CDS_LMAN_SYM_OUTLINE: -50,50,50,-50; FP_TECH: TK2; IP: GENERIC; ROOM: NONE; OriginalSymbolOrigin: (-50,25); XY: (-2900,775); VER: 1; ROT: 0; PHYS_PAGE: 93; LOCATION: C7C20; DRAWING: @RVP1_ADL_SB_ADP_S_DDR5_SODIMM_2DPC_LIB.H55_DG2_2DPC(SCH_1):PAGE464; CDS_LIB: c_discrete; VARIANT: ?; PCB Footprint: CTK2_SM0402_1050X550_MA; CHIPS_PART_NAME: C_CAP; CDS_PART_NAME: C_CAP_0402-A36096-100,X7R,0.01UF,50V,10%,TK2,GENERIC; CDS_LOCATION: C7C20
C7C21 = C_CAP: PART_NUMBER: A36096-100; CDS_PHYS_PART_NAME: C_CAP_0402-A36096-100,X7R,0.01UF,50V,10%,TK2,GENERIC; CDS_LMAN_SYM_OUTLINE: -50,50,50,-50; FP_TECH: TK2; IP: GENERIC; ROOM: NONE; OriginalSymbolOrigin: (-50,25); XY: (-1050,750); VER: 1; ROT: 0; PHYS_PAGE: 93; LOCATION: C7C21; DRAWING: @RVP1_ADL_SB_ADP_S_DDR5_SODIMM_2DPC_LIB.H55_DG2_2DPC(SCH_1):PAGE464; CDS_LIB: c_discrete; VARIANT: ?; PCB Footprint: CTK2_SM0402_1050X550_MA; CHIPS_PART_NAME: C_CAP; CDS_PART_NAME: C_CAP_0402-A36096-100,X7R,0.01UF,50V,10%,TK2,GENERIC; CDS_LOCATION: C7C21
C7C22 = CAP: PART_NUMBER: G33975-001; CDS_PHYS_PART_NAME: CAP_0603-G33975-001,X5R,10UF,25V,20%,LPDB,GENERIC; OriginalSymbolOrigin: (-50,25); sec: 1; XY: (-550,750); ROT: 0; PHYS_PAGE: 93; LOCATION: C7C22; IP: GENERIC; FP_TECH: LPDB; DRAWING: @RVP1_ADL_SB_ADP_S_DDR5_SODIMM_2DPC_LIB.H55_DG2_2DPC(SCH_1):PAGE464; CDS_LIB: discrete; PCB Footprint: SMC0603IA; VER: 1; CHIPS_PART_NAME: CAP; CDS_PART_NAME: CAP_0603-G33975-001,X5R,10UF,25V,20%,LPDB,GENERIC; CDS_LOCATION: C7C22; ASI_MODEL: G33975-001
J7C1 = C_M2_75P_KEYE_2EM: CDS_PHYS_PART_NAME: C_M2_75P_KEYE_2EM_SM-G64002-001,CON,M2_75P_KEYE_2EM,TK0,GENERIC; CDS_LMAN_SYM_OUTLINE: -700,2100,700,-2100; FP_TECH: TK0; IP: GENERIC; PACK_TYPE: SM; ROOM: NONE; OriginalSymbolOrigin: (-750,2100); XY: (-5075,2450); VER: 1; ROT: 0; PHYS_PAGE: 93; LOCATION: J7C1; DRAWING: @RVP1_ADL_SB_ADP_S_DDR5_SODIMM_2DPC_LIB.H55_DG2_2DPC(SCH_1):PAGE464; CDS_LIB: local; VARIANT: ?; PCB Footprint: CTK0_M2_SJR_75P_KEYE_2EM_2M_500_MA_VR; SEC_TYPE: SM; CHIPS_PART_NAME: C_M2_75P_KEYE_2EM; CDS_PART_NAME: C_M2_75P_KEYE_2EM_SM-G64002-001,CON,M2_75P_KEYE_2EM,TK0,GENERIC; CDS_LOCATION: J7C1
R6F28 = RES#1: PART_NUMBER: A93549-001; CHIPS_PART_NAME: RES; CDS_PHYS_PART_NAME: RES_0402-A93549-001,CHIP,0,5%,1/16W,LPDB,GENERIC; PACK_TYPE: 0402; WATTAGE: 1/16W; OriginalSymbolOrigin: (-75,25); XY: (-1400,4300); VER: 1; PHYS_PAGE: 93; LOCATION: R6F28; IP: GENERIC; FP_TECH: LPDB; FIN: CLK; DRAWING: @RVP1_ADL_SB_ADP_S_DDR5_SODIMM_2DPC_LIB.H55_DG2_2DPC(SCH_1):PAGE464; CDS_LIB: discrete; PCB Footprint: SMR0402IA; SEC_TYPE: 0402; ROT: 0; CDS_PART_NAME: RES_0402-A93549-001,CHIP,0,5%,1/16W,LPDB,GENERIC; CDS_LOCATION: R6F28; ASI_MODEL: A93549-001
R6F34 = RES: PART_NUMBER: A93548-034; CDS_PHYS_PART_NAME: RES_0402-A93548-034,CHIP,10K,1%,1/16W,LPDB,GENERIC; PACK_TYPE: 0402; WATTAGE: 1/16W; OriginalSymbolOrigin: (-25,75); XY: (-1025,4450); VER: 2; ROT: 0; PHYS_PAGE: 93; LOCATION: R6F34; IP: GENERIC; FP_TECH: LPDB; DRAWING: @RVP1_ADL_SB_ADP_S_DDR5_SODIMM_2DPC_LIB.H55_DG2_2DPC(SCH_1):PAGE464; CDS_LIB: discrete; PCB Footprint: SMR0402IA; CHIPS_PART_NAME: RES; CDS_PART_NAME: RES_0402-A93548-034,CHIP,10K,1%,1/16W,LPDB,GENERIC; CDS_LOCATION: R6F34; ASI_MODEL: A93548-034
R7C9 = C_RES#1: PART_NUMBER: H30143-001; CHIPS_PART_NAME: C_RES; CDS_PHYS_PART_NAME: C_RES_0201-H30143-001,RES,0,5%,0.05W,TK2,GENERIC; CDS_LMAN_SYM_OUTLINE: -50,50,50,-50; FP_TECH: TK2; IP: GENERIC; ROOM: NONE; WATTAGE: 0.05W; OriginalSymbolOrigin: (-75,25); XY: (-6875,4050); VER: 1; PHYS_PAGE: 93; LOCATION: R7C9; DRAWING: @RVP1_ADL_SB_ADP_S_DDR5_SODIMM_2DPC_LIB.H55_DG2_2DPC(SCH_1):PAGE464; CDS_LIB: c_discrete; MATERIAL: RES; VARIANT: ?; PCB Footprint: CTK2_SM0201_630X330_MA; ROT: 0; CDS_PART_NAME: C_RES_0201-H30143-001,RES,0,5%,0.05W,TK2,GENERIC; CDS_LOCATION: R7C9
R7C10 = C_RES#1: PART_NUMBER: H30143-001; CHIPS_PART_NAME: C_RES; CDS_PHYS_PART_NAME: C_RES_0201-H30143-001,RES,0,5%,0.05W,TK2,GENERIC; CDS_LMAN_SYM_OUTLINE: -50,50,50,-50; FP_TECH: TK2; IP: GENERIC; ROOM: NONE; WATTAGE: 0.05W; OriginalSymbolOrigin: (-75,25); XY: (-6875,3950); VER: 1; PHYS_PAGE: 93; LOCATION: R7C10; DRAWING: @RVP1_ADL_SB_ADP_S_DDR5_SODIMM_2DPC_LIB.H55_DG2_2DPC(SCH_1):PAGE464; CDS_LIB: c_discrete; MATERIAL: RES; VARIANT: ?; PCB Footprint: CTK2_SM0201_630X330_MA; ROT: 0; CDS_PART_NAME: C_RES_0201-H30143-001,RES,0,5%,0.05W,TK2,GENERIC; CDS_LOCATION: R7C10
R7C11 = C_RES#1: PART_NUMBER: H30143-001; CHIPS_PART_NAME: C_RES; CDS_PHYS_PART_NAME: C_RES_0201-H30143-001,RES,0,5%,0.05W,TK2,GENERIC; CDS_LMAN_SYM_OUTLINE: -50,50,50,-50; FP_TECH: TK2; IP: GENERIC; ROOM: NONE; WATTAGE: 0.05W; OriginalSymbolOrigin: (-75,25); XY: (-6875,3750); VER: 1; PHYS_PAGE: 93; LOCATION: R7C11; DRAWING: @RVP1_ADL_SB_ADP_S_DDR5_SODIMM_2DPC_LIB.H55_DG2_2DPC(SCH_1):PAGE464; CDS_LIB: c_discrete; MATERIAL: RES; VARIANT: ?; PCB Footprint: CTK2_SM0201_630X330_MA; ROT: 0; CDS_PART_NAME: C_RES_0201-H30143-001,RES,0,5%,0.05W,TK2,GENERIC; CDS_LOCATION: R7C11
R7C13 = C_RES#1: PART_NUMBER: H30143-001; CHIPS_PART_NAME: C_RES; CDS_PHYS_PART_NAME: C_RES_0201-H30143-001,RES,0,5%,0.05W,TK2,GENERIC; CDS_LMAN_SYM_OUTLINE: -50,50,50,-50; FP_TECH: TK2; IP: GENERIC; ROOM: NONE; WATTAGE: 0.05W; OriginalSymbolOrigin: (-75,25); XY: (-6875,3650); VER: 1; PHYS_PAGE: 93; LOCATION: R7C13; DRAWING: @RVP1_ADL_SB_ADP_S_DDR5_SODIMM_2DPC_LIB.H55_DG2_2DPC(SCH_1):PAGE464; CDS_LIB: c_discrete; MATERIAL: RES; VARIANT: ?; PCB Footprint: CTK2_SM0201_630X330_MA; ROT: 0; CDS_PART_NAME: C_RES_0201-H30143-001,RES,0,5%,0.05W,TK2,GENERIC; CDS_LOCATION: R7C13
R7C14 = C_RES#1: PART_NUMBER: H30143-001; CHIPS_PART_NAME: C_RES; CDS_PHYS_PART_NAME: C_RES_0201-H30143-001,RES,0,5%,0.05W,TK2,GENERIC; CDS_LMAN_SYM_OUTLINE: -50,50,50,-50; FP_TECH: TK2; IP: GENERIC; ROOM: NONE; WATTAGE: 0.05W; OriginalSymbolOrigin: (-75,25); XY: (-6875,3450); VER: 1; PHYS_PAGE: 93; LOCATION: R7C14; DRAWING: @RVP1_ADL_SB_ADP_S_DDR5_SODIMM_2DPC_LIB.H55_DG2_2DPC(SCH_1):PAGE464; CDS_LIB: c_discrete; MATERIAL: RES; VARIANT: ?; PCB Footprint: CTK2_SM0201_630X330_MA; ROT: 0; CDS_PART_NAME: C_RES_0201-H30143-001,RES,0,5%,0.05W,TK2,GENERIC; CDS_LOCATION: R7C14
R7C15 = C_RES#1: PART_NUMBER: H30143-001; CHIPS_PART_NAME: C_RES; CDS_PHYS_PART_NAME: C_RES_0201-H30143-001,RES,0,5%,0.05W,TK2,GENERIC; CDS_LMAN_SYM_OUTLINE: -50,50,50,-50; FP_TECH: TK2; IP: GENERIC; ROOM: NONE; WATTAGE: 0.05W; OriginalSymbolOrigin: (-75,25); XY: (-6875,3350); VER: 1; PHYS_PAGE: 93; LOCATION: R7C15; DRAWING: @RVP1_ADL_SB_ADP_S_DDR5_SODIMM_2DPC_LIB.H55_DG2_2DPC(SCH_1):PAGE464; CDS_LIB: c_discrete; MATERIAL: RES; VARIANT: ?; PCB Footprint: CTK2_SM0201_630X330_MA; ROT: 0; CDS_PART_NAME: C_RES_0201-H30143-001,RES,0,5%,0.05W,TK2,GENERIC; CDS_LOCATION: R7C15
R7C17 = RES#1: PART_NUMBER: A93549-036; CHIPS_PART_NAME: RES; CDS_PHYS_PART_NAME: RES_0402-A93549-036,EMPTY,20K,5%,1/16W,LPDB,GENERIC; WATTAGE: 1/16W; OriginalSymbolOrigin: (-75,25); XY: (-2900,2975); VER: 1; ROT: 0; PHYS_PAGE: 93; LOCATION: R7C17; IP: GENERIC; FP_TECH: LPDB; FIN: DP; DRAWING: @RVP1_ADL_SB_ADP_S_DDR5_SODIMM_2DPC_LIB.H55_DG2_2DPC(SCH_1):PAGE464; CDS_LIB: discrete; BOM: HDMI; PCB Footprint: SMR0402IA; CDS_PART_NAME: RES_0402-A93549-036,EMPTY,20K,5%,1/16W,LPDB,GENERIC; CDS_LOCATION: R7C17; ASI_MODEL: A93549-036
R7C19 = RES#1: CHIPS_PART_NAME: RES; CDS_PHYS_PART_NAME: RES_0402-A93549-036,EMPTY,20K,5%,1/16W,LPDB,GENERIC; WATTAGE: 1/16W; OriginalSymbolOrigin: (-75,25); XY: (-2900,3150); VER: 1; ROT: 0; PHYS_PAGE: 93; LOCATION: R7C19; IP: GENERIC; FP_TECH: LPDB; FIN: DP; DRAWING: @RVP1_ADL_SB_ADP_S_DDR5_SODIMM_2DPC_LIB.H55_DG2_2DPC(SCH_1):PAGE464; CDS_LIB: discrete; BOM: HDMI; PCB Footprint: SMR0402IA; CDS_PART_NAME: RES_0402-A93549-036,EMPTY,20K,5%,1/16W,LPDB,GENERIC; CDS_LOCATION: R7C19; ASI_MODEL: A93549-036
R7C24 = RES#1: PART_NUMBER: A93548-034; CHIPS_PART_NAME: RES; CDS_PHYS_PART_NAME: RES_0402-A93548-034,CHIP,10K,1%,1/16W,LPDB,GENERIC; WATTAGE: 1/16W; OriginalSymbolOrigin: (-75,25); XY: (-1025,4050); VER: 1; ROT: 3; PHYS_PAGE: 93; LOCATION: R7C24; IP: GENERIC; FP_TECH: LPDB; FIN: EC; DRAWING: @RVP1_ADL_SB_ADP_S_DDR5_SODIMM_2DPC_LIB.H55_DG2_2DPC(SCH_1):PAGE464; CDS_LIB: discrete; PCB Footprint: SMR0402IA; CDS_PART_NAME: RES_0402-A93548-034,CHIP,10K,1%,1/16W,LPDB,GENERIC; CDS_LOCATION: R7C24; ASI_MODEL: A93548-034
R7C25 = RES#4: CHIPS_PART_NAME: RES; CDS_PHYS_PART_NAME: RES_0402-A93549-001,EMPTY,0,5%,1/16W,LPDB,GENERIC; CDS_LMAN_SYM_OUTLINE: -50,25,50,-25; FP_TECH: LPDB; IP: GENERIC; WATTAGE: 1/16W; OriginalSymbolOrigin: (-75,25); XY: (-1275,3850); VER: 10; ROT: 2; PHYS_PAGE: 93; LOCATION: R7C25; DRAWING: @RVP1_ADL_SB_ADP_S_DDR5_SODIMM_2DPC_LIB.H55_DG2_2DPC(SCH_1):PAGE464; CDS_LIB: discrete; PCB Footprint: SMR0402IA; CDS_PART_NAME: RES_0402-A93549-001,EMPTY,0,5%,1/16W,LPDB,GENERIC; CDS_LOCATION: R7C25; ASI_MODEL: A93549-001
R7C35 = RES#1: PART_NUMBER: A93549-001; CHIPS_PART_NAME: RES; CDS_PHYS_PART_NAME: RES_0402-A93549-001,CHIP,0,5%,1/16W,LPDB,GENERIC; TOLERANCE: 5%; WATTAGE: 1/16W; OriginalSymbolOrigin: (-75,25); XY: (-3400,1750); VER: 1; PHYS_PAGE: 93; LOCATION: R7C35; IP: GENERIC; FP_TECH: LPDB; DRAWING: @RVP1_ADL_SB_ADP_S_DDR5_SODIMM_2DPC_LIB.H55_DG2_2DPC(SCH_1):PAGE464; CDS_LIB: discrete; PCB Footprint: SMR0402IA; ROT: 0; CDS_PART_NAME: RES_0402-A93549-001,CHIP,0,5%,1/16W,LPDB,GENERIC; CDS_LOCATION: R7C35; ASI_MODEL: A93549-001
R7N26 = RES#1: CHIPS_PART_NAME: RES; CDS_PHYS_PART_NAME: RES_0201-C80792-009,EMPTY,0,5%,1/20W,LPDB,GENERIC; TOLERANCE: 5%; WATTAGE: 1/20W; OriginalSymbolOrigin: (-75,25); XY: (-1325,2900); VER: 1; ROOM: ROOM_PROP_TEST_178; PHYS_PAGE: 93; LOCATION: R7N26; IP: GENERIC; FP_TECH: LPDB; DRAWING: @RVP1_ADL_SB_ADP_S_DDR5_SODIMM_2DPC_LIB.H55_DG2_2DPC(SCH_1):PAGE464; CDS_LIB: discrete; PCB Footprint: SMR0201IA; ROT: 0; CDS_PART_NAME: RES_0201-C80792-009,EMPTY,0,5%,1/20W,LPDB,GENERIC; CDS_LOCATION: R7N26
R7N28 = RES#1: CHIPS_PART_NAME: RES; CDS_PHYS_PART_NAME: RES_0201-C80792-009,CHIP,0,5%,1/20W,LPDB,GENERIC; TOLERANCE: 5%; WATTAGE: 1/20W; OriginalSymbolOrigin: (-75,25); XY: (-1325,3125); VER: 1; ROOM: ROOM_PROP_TEST_178; PHYS_PAGE: 93; LOCATION: R7N28; IP: GENERIC; FP_TECH: LPDB; DRAWING: @RVP1_ADL_SB_ADP_S_DDR5_SODIMM_2DPC_LIB.H55_DG2_2DPC(SCH_1):PAGE464; CDS_LIB: discrete; PCB Footprint: SMR0201IA; ROT: 0; CDS_PART_NAME: RES_0201-C80792-009,CHIP,0,5%,1/20W,LPDB,GENERIC; CDS_LOCATION: R7N28
R7N31 = RES#1: CHIPS_PART_NAME: RES; CDS_PHYS_PART_NAME: RES_0201-C80792-009,CHIP,0,5%,1/20W,LPDB,GENERIC; TOLERANCE: 5%; WATTAGE: 1/20W; OriginalSymbolOrigin: (-75,25); XY: (-1325,2650); VER: 1; ROOM: ROOM_PROP_TEST_178; PHYS_PAGE: 93; LOCATION: R7N31; IP: GENERIC; FP_TECH: LPDB; DRAWING: @RVP1_ADL_SB_ADP_S_DDR5_SODIMM_2DPC_LIB.H55_DG2_2DPC(SCH_1):PAGE464; CDS_LIB: discrete; PCB Footprint: SMR0201IA; ROT: 0; CDS_PART_NAME: RES_0201-C80792-009,CHIP,0,5%,1/20W,LPDB,GENERIC; CDS_LOCATION: R7N31
R7N32 = RES#1: CHIPS_PART_NAME: RES; CDS_PHYS_PART_NAME: RES_0201-C80792-009,CHIP,0,5%,1/20W,LPDB,GENERIC; TOLERANCE: 5%; WATTAGE: 1/20W; OriginalSymbolOrigin: (-75,25); XY: (-1350,2200); VER: 1; ROOM: ROOM_PROP_TEST_178; PHYS_PAGE: 93; LOCATION: R7N32; IP: GENERIC; FP_TECH: LPDB; DRAWING: @RVP1_ADL_SB_ADP_S_DDR5_SODIMM_2DPC_LIB.H55_DG2_2DPC(SCH_1):PAGE464; CDS_LIB: discrete; PCB Footprint: SMR0201IA; ROT: 0; CDS_PART_NAME: RES_0201-C80792-009,CHIP,0,5%,1/20W,LPDB,GENERIC; CDS_LOCATION: R7N32
R7T33 = RES#1: PART_NUMBER: A93549-001; CHIPS_PART_NAME: RES; CDS_PHYS_PART_NAME: RES_0402-A93549-001,CHIP,0,5%,1/16W,LPDB,GENERIC; PACK_TYPE: 0402; WATTAGE: 1/16W; OriginalSymbolOrigin: (-75,25); XY: (-1300,3550); VER: 1; PHYS_PAGE: 93; LOCATION: R7T33; IP: GENERIC; FP_TECH: LPDB; FIN: CLK; DRAWING: @RVP1_ADL_SB_ADP_S_DDR5_SODIMM_2DPC_LIB.H55_DG2_2DPC(SCH_1):PAGE464; CDS_LIB: discrete; PCB Footprint: SMR0402IA; SEC_TYPE: 0402; ROT: 0; CDS_PART_NAME: RES_0402-A93549-001,CHIP,0,5%,1/16W,LPDB,GENERIC; CDS_LOCATION: R7T33; ASI_MODEL: A93549-001
R8C1 = RES: CDS_PHYS_PART_NAME: RES_0402-A93548-034,CHIP,10K,1%,1/16W,LPDB,GENERIC; WATTAGE: 1/16W; OriginalSymbolOrigin: (-25,75); XY: (-2575,4725); VER: 2; ROT: 0; PHYS_PAGE: 93; LOCATION: R8C1; IP: GENERIC; FP_TECH: LPDB; DRAWING: @RVP1_ADL_SB_ADP_S_DDR5_SODIMM_2DPC_LIB.H55_DG2_2DPC(SCH_1):PAGE464; CDS_LIB: discrete; PCB Footprint: SMR0402IA; CHIPS_PART_NAME: RES; CDS_PART_NAME: RES_0402-A93548-034,CHIP,10K,1%,1/16W,LPDB,GENERIC; CDS_LOCATION: R8C1; ASI_MODEL: A93548-034
R8C7 = RES: CDS_PHYS_PART_NAME: RES_0402-A93548-034,CHIP,10K,1%,1/16W,LPDB,GENERIC; WATTAGE: 1/16W; OriginalSymbolOrigin: (-25,75); XY: (-3750,4725); VER: 2; ROT: 0; PHYS_PAGE: 93; LOCATION: R8C7; IP: GENERIC; FP_TECH: LPDB; DRAWING: @RVP1_ADL_SB_ADP_S_DDR5_SODIMM_2DPC_LIB.H55_DG2_2DPC(SCH_1):PAGE464; CDS_LIB: discrete; PCB Footprint: SMR0402IA; CHIPS_PART_NAME: RES; CDS_PART_NAME: RES_0402-A93548-034,CHIP,10K,1%,1/16W,LPDB,GENERIC; CDS_LOCATION: R8C7; ASI_MODEL: A93548-034
R8C8 = RES#1: CHIPS_PART_NAME: RES; CDS_PHYS_PART_NAME: RES_0402-A93548-325,CHIP,75K,1%,1/16W,LPDB,GENERIC; WATTAGE: 1/16W; OriginalSymbolOrigin: (-75,25); XY: (-3225,4000); VER: 1; ROT: 0; PHYS_PAGE: 93; LOCATION: R8C8; IP: GENERIC; FP_TECH: LPDB; DRAWING: @RVP1_ADL_SB_ADP_S_DDR5_SODIMM_2DPC_LIB.H55_DG2_2DPC(SCH_1):PAGE464; CDS_LIB: discrete; PCB Footprint: SMR0402IA; CDS_PART_NAME: RES_0402-A93548-325,CHIP,75K,1%,1/16W,LPDB,GENERIC; CDS_LOCATION: R8C8; ASI_MODEL: A93548-325
R8C10 = RES#1: PART_NUMBER: A93548-325; CHIPS_PART_NAME: RES; CDS_PHYS_PART_NAME: RES_0402-A93548-325,CHIP,75K,1%,1/16W,LPDB,GENERIC; WATTAGE: 1/16W; OriginalSymbolOrigin: (-75,25); XY: (-3225,3800); VER: 1; ROT: 0; PHYS_PAGE: 93; LOCATION: R8C10; IP: GENERIC; FP_TECH: LPDB; DRAWING: @RVP1_ADL_SB_ADP_S_DDR5_SODIMM_2DPC_LIB.H55_DG2_2DPC(SCH_1):PAGE464; CDS_LIB: discrete; PCB Footprint: SMR0402IA; CDS_PART_NAME: RES_0402-A93548-325,CHIP,75K,1%,1/16W,LPDB,GENERIC; CDS_LOCATION: R8C10; ASI_MODEL: A93548-325
R8C13 = RES#1: CHIPS_PART_NAME: RES; CDS_PHYS_PART_NAME: RES_0402-A93548-034,CHIP,10K,1%,1/16W,LPDB,GENERIC; WATTAGE: 1/16W; OriginalSymbolOrigin: (-75,25); XY: (-3500,3300); VER: 1; ROT: 0; PHYS_PAGE: 93; LOCATION: R8C13; IP: GENERIC; FP_TECH: LPDB; DRAWING: @RVP1_ADL_SB_ADP_S_DDR5_SODIMM_2DPC_LIB.H55_DG2_2DPC(SCH_1):PAGE464; CDS_LIB: discrete; PCB Footprint: SMR0402IA; CDS_PART_NAME: RES_0402-A93548-034,CHIP,10K,1%,1/16W,LPDB,GENERIC; CDS_LOCATION: R8C13; ASI_MODEL: A93548-034
R8D7 = RES#1: PART_NUMBER: A93549-001; CHIPS_PART_NAME: RES; CDS_PHYS_PART_NAME: RES_0402-A93549-001,CHIP,0,5%,1/16W,LPDB,GENERIC; PACK_TYPE: 0402; WATTAGE: 1/16W; OriginalSymbolOrigin: (-75,25); XY: (-1225,3425); VER: 1; PHYS_PAGE: 93; LOCATION: R8D7; IP: GENERIC; FP_TECH: LPDB; DRAWING: @RVP1_ADL_SB_ADP_S_DDR5_SODIMM_2DPC_LIB.H55_DG2_2DPC(SCH_1):PAGE464; CDS_LIB: discrete; PCB Footprint: SMR0402IA; ROT: 0; CDS_PART_NAME: RES_0402-A93549-001,CHIP,0,5%,1/16W,LPDB,GENERIC; CDS_LOCATION: R8D7; ASI_MODEL: A93549-001
R8D11 = RES#1: PART_NUMBER: A93549-001; CHIPS_PART_NAME: RES; CDS_PHYS_PART_NAME: RES_0402-A93549-001,CHIP,0,5%,1/16W,LPDB,GENERIC; PACK_TYPE: 0402; WATTAGE: 1/16W; OriginalSymbolOrigin: (-75,25); XY: (-1225,3300); VER: 1; PHYS_PAGE: 93; LOCATION: R8D11; IP: GENERIC; FP_TECH: LPDB; DRAWING: @RVP1_ADL_SB_ADP_S_DDR5_SODIMM_2DPC_LIB.H55_DG2_2DPC(SCH_1):PAGE464; CDS_LIB: discrete; PCB Footprint: SMR0402IA; ROT: 0; CDS_PART_NAME: RES_0402-A93549-001,CHIP,0,5%,1/16W,LPDB,GENERIC; CDS_LOCATION: R8D11; ASI_MODEL: A93549-001
R9D52 = RES#1: PART_NUMBER: A93549-001; CHIPS_PART_NAME: RES; CDS_PHYS_PART_NAME: RES_0402-A93549-001,CHIP,0,5%,1/16W,LPDB,GENERIC; WATTAGE: 1/16W; OriginalSymbolOrigin: (-75,25); XY: (-1275,1350); VER: 1; PHYS_PAGE: 93; LOCATION: R9D52; IP: GENERIC; FP_TECH: LPDB; FIN: DEBUG; DRAWING: @RVP1_ADL_SB_ADP_S_DDR5_SODIMM_2DPC_LIB.H55_DG2_2DPC(SCH_1):PAGE464; CDS_LIB: discrete; BOM: PCH; PCB Footprint: SMR0402IA; ROT: 0; CDS_PART_NAME: RES_0402-A93549-001,CHIP,0,5%,1/16W,LPDB,GENERIC; CDS_LOCATION: R9D52; ASI_MODEL: A93549-001
R9D55 = RES#1: PART_NUMBER: A93549-001; CHIPS_PART_NAME: RES; CDS_PHYS_PART_NAME: RES_0402-A93549-001,CHIP,0,5%,1/16W,LPDB,GENERIC; WATTAGE: 1/16W; OriginalSymbolOrigin: (-75,25); XY: (-1275,1550); VER: 1; PHYS_PAGE: 93; LOCATION: R9D55; IP: GENERIC; FP_TECH: LPDB; FIN: DEBUG; DRAWING: @RVP1_ADL_SB_ADP_S_DDR5_SODIMM_2DPC_LIB.H55_DG2_2DPC(SCH_1):PAGE464; CDS_LIB: discrete; BOM: PCH; PCB Footprint: SMR0402IA; ROT: 0; CDS_PART_NAME: RES_0402-A93549-001,CHIP,0,5%,1/16W,LPDB,GENERIC; CDS_LOCATION: R9D55; ASI_MODEL: A93549-001
R9D57 = RES#1: PART_NUMBER: A93549-001; CHIPS_PART_NAME: RES; CDS_PHYS_PART_NAME: RES_0402-A93549-001,CHIP,0,5%,1/16W,LPDB,GENERIC; WATTAGE: 1/16W; OriginalSymbolOrigin: (-75,25); XY: (-1250,1775); VER: 1; PHYS_PAGE: 93; LOCATION: R9D57; IP: GENERIC; FP_TECH: LPDB; FIN: DEBUG; DRAWING: @RVP1_ADL_SB_ADP_S_DDR5_SODIMM_2DPC_LIB.H55_DG2_2DPC(SCH_1):PAGE464; CDS_LIB: discrete; BOM: PCH; PCB Footprint: SMR0402IA; ROT: 0; CDS_PART_NAME: RES_0402-A93549-001,CHIP,0,5%,1/16W,LPDB,GENERIC; CDS_LOCATION: R9D57; ASI_MODEL: A93549-001
R9301 = RES#1: CHIPS_PART_NAME: RES; CDS_PHYS_PART_NAME: RES_0201-C80792-009,EMPTY,0,5%,1/20W,LPDB,GENERIC; TOLERANCE: 5%; WATTAGE: 1/20W; OriginalSymbolOrigin: (-75,25); XY: (-1325,2425); VER: 1; ROOM: ROOM_PROP_TEST_178; PHYS_PAGE: 93; LOCATION: R9301; IP: GENERIC; FP_TECH: LPDB; DRAWING: @RVP1_ADL_SB_ADP_S_DDR5_SODIMM_2DPC_LIB.H55_DG2_2DPC(SCH_1):PAGE464; CDS_LIB: discrete; PCB Footprint: SMR0201IA; ROT: 0; CDS_PART_NAME: RES_0201-C80792-009,EMPTY,0,5%,1/20W,LPDB,GENERIC; CDS_LOCATION: R9301
R9302 = RES#1: CHIPS_PART_NAME: RES; CDS_PHYS_PART_NAME: RES_0201-C80792-009,EMPTY,0,5%,1/20W,LPDB,GENERIC; TOLERANCE: 5%; WATTAGE: 1/20W; OriginalSymbolOrigin: (-75,25); XY: (-1325,1975); VER: 1; ROOM: ROOM_PROP_TEST_178; PHYS_PAGE: 93; LOCATION: R9302; IP: GENERIC; FP_TECH: LPDB; DRAWING: @RVP1_ADL_SB_ADP_S_DDR5_SODIMM_2DPC_LIB.H55_DG2_2DPC(SCH_1):PAGE464; CDS_LIB: discrete; PCB Footprint: SMR0201IA; ROT: 0; CDS_PART_NAME: RES_0201-C80792-009,EMPTY,0,5%,1/20W,LPDB,GENERIC; CDS_LOCATION: R9302
RM8C1 = MTG_HOLE_2: CDS_PHYS_PART_NAME: MTG_HOLE_2_TH-NA_69252,EMPTY,MTG_HOLE,TK0,GENERIC; CDS_LMAN_SYM_OUTLINE: -200,100,200,-100; FP_TECH: TK0; IP: GENERIC; PACK_TYPE: TH; ROOM: NONE; OriginalSymbolOrigin: (-225,100); XY: (-3525,300); VER: 1; ROT: 0; PHYS_PAGE: 93; LOCATION: RM8C1; DRAWING: @RVP1_ADL_SB_ADP_S_DDR5_SODIMM_2DPC_LIB.H55_DG2_2DPC(SCH_1):PAGE464; CDS_LIB: local; VARIANT: ?; PCB Footprint: MTG_5000P3500_MA; CHIPS_PART_NAME: MTG_HOLE_2; CDS_PART_NAME: MTG_HOLE_2_TH-NA_69252,EMPTY,MTG_HOLE,TK0,GENERIC; CDS_LOCATION: RM8C1